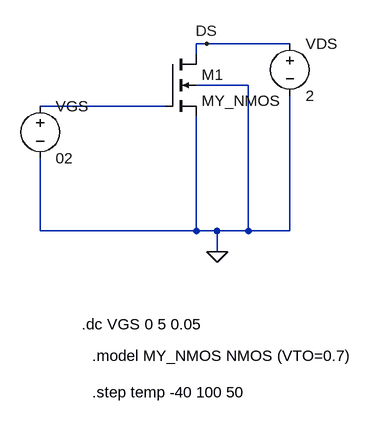
[diagram p0: schematic Effect_of_Temperature_on_threshold_volatge_and_current.asc]
Effect_of_Temperature_on_threshold_volatge_and_current.asc, the LTspice schematic file:
Version 4.1
SHEET 1 880 680
WIRE 128 -80 112 -80
WIRE 256 -80 128 -80
WIRE 112 -64 112 -80
WIRE 192 -16 112 -16
WIRE 64 16 -128 16
WIRE -128 208 -128 96
WIRE 112 208 112 32
WIRE 112 208 -128 208
WIRE 144 208 112 208
WIRE 192 208 192 -16
WIRE 192 208 144 208
WIRE 256 208 256 0
WIRE 256 208 192 208
WIRE 144 240 144 208
FLAG 128 -80 DS
FLAG 144 240 0
SYMBOL voltage -128 0 R0
WINDOW 123 0 0 Left 0
WINDOW 39 0 0 Left 0
SYMATTR InstName VGS
SYMATTR Value 02
SYMBOL voltage 256 -96 R0
WINDOW 123 0 0 Left 0
WINDOW 39 0 0 Left 0
SYMATTR InstName VDS
SYMATTR Value 2
SYMBOL nmos4 64 -64 R0
SYMATTR InstName M1
SYMATTR Value MY_NMOS
TEXT -64 352 Left 2 !.dc VGS 0 5 0.05
TEXT -48 400 Left 2 !.model MY_NMOS NMOS (VTO=0.7)
TEXT -48 456 Left 2 !.step temp -40 100 50

The netlist it stands for:
* Effect_of_Temperature_on_threshold_volatge_and_current.asc
VGS N001 0 02
VDS DS 0 2
M1 DS N001 0 0 MY_NMOS
.model NMOS NMOS
.model PMOS PMOS
.lib standard.mos
.dc VGS 0 5 0.05
.model MY_NMOS NMOS (VTO=0.7)
.step temp -40 100 50
.backanno
.end